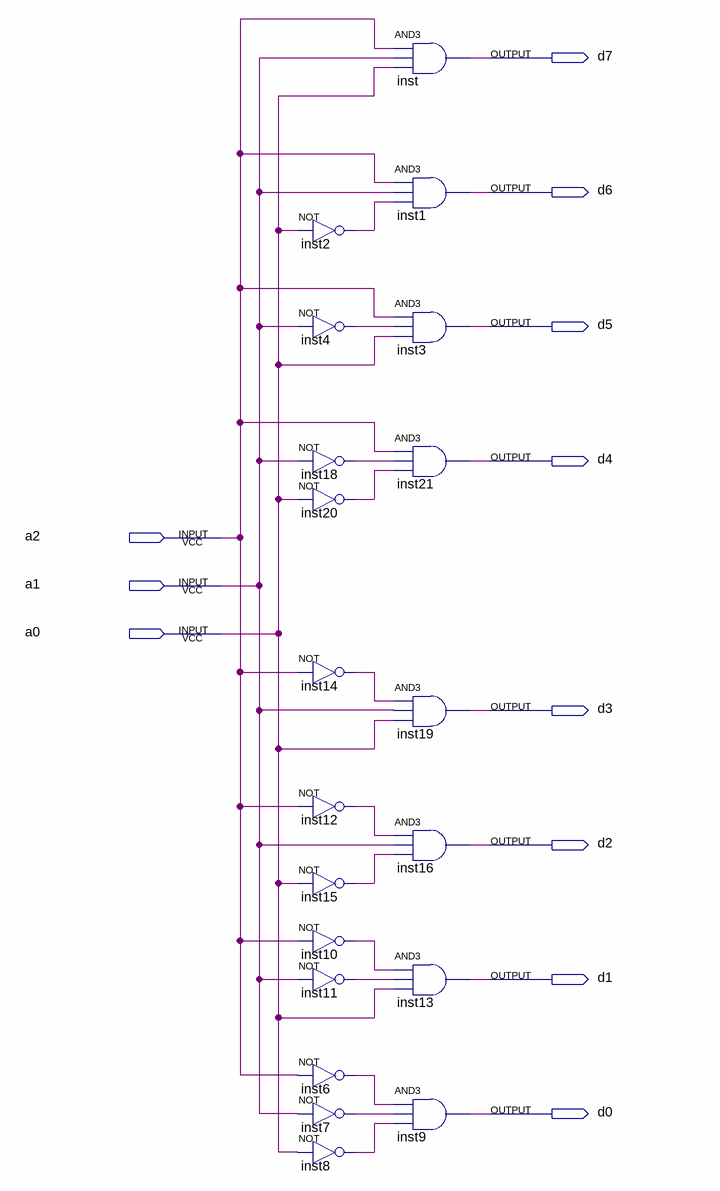
[diagram p0: schematic sheet]
// Quartus schematic 3-8.bdf as structural Verilog: 20 symbols, 11 pins
module \3-8  (
  input  a2,
  input  a1,
  input  a0,
  output d7,
  output d6,
  output d5,
  output d4,
  output d3,
  output d2,
  output d1,
  output d0
);

  wire inst2_out, inst4_out, inst6_out, inst7_out, inst8_out, inst10_out, inst11_out, inst12_out, inst14_out,
       inst15_out, inst18_out, inst20_out;

  not inst2 (inst2_out, a0);
  not inst4 (inst4_out, a1);
  not inst18 (inst18_out, a1);
  not inst20 (inst20_out, a0);
  not inst14 (inst14_out, a2);
  not inst12 (inst12_out, a2);
  not inst15 (inst15_out, a0);
  not inst10 (inst10_out, a2);
  not inst11 (inst11_out, a1);
  not inst6 (inst6_out, a2);
  not inst7 (inst7_out, a1);
  not inst8 (inst8_out, a0);
  and inst (d7, a2, a1, a0);
  and inst1 (d6, a2, a1, inst2_out);
  and inst3 (d5, a2, inst4_out, a0);
  and inst21 (d4, a2, inst18_out, inst20_out);
  and inst19 (d3, inst14_out, a1, a0);
  and inst16 (d2, inst12_out, a1, inst15_out);
  and inst13 (d1, inst10_out, inst11_out, a0);
  and inst9 (d0, inst6_out, inst7_out, inst8_out);
endmodule
